# Altium schematic sheet ET-FPGAIO.SchDoc
size A4
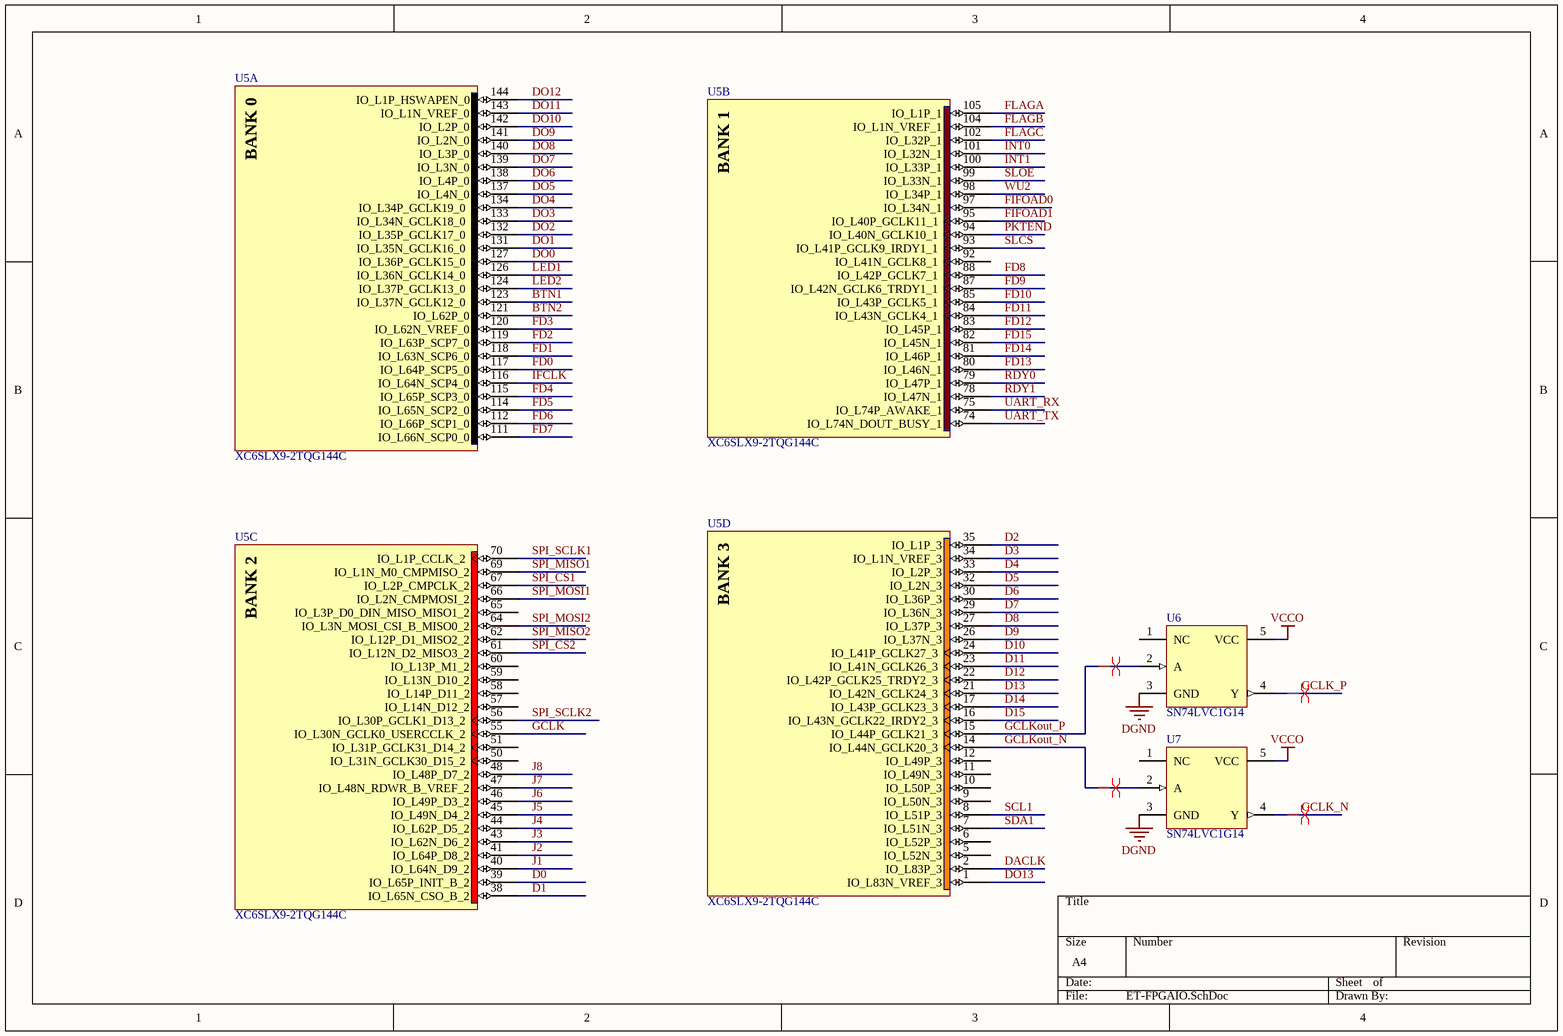
[diagram p0: ET-FPGAIO.SchDoc]

## Parts
U5  XC6SLX9-2TQG144C  [TQG144_N]  (parts A,B,C,D of 7)
U6  SN74LVC1G14  [SOT-23-5]
U7  SN74LVC1G14  [SOT-23-5]

## Nets
DGND: U6.3(GND) U7.3(GND)
VCCO: U6.5(VCC) U7.5(VCC)
~{INT0}: U5.101(IO_L32N_1)
~{INT1}: U5.100(IO_L33P_1)
~{SLCS}: U5.93(IO_L41P_GCLK9_IRDY1_1)
BTN1: U5.123(IO_L37N_GCLK12_0)
BTN2: U5.121(IO_L62P_0)
D0: U5.39(IO_L65P_INIT_B_2)
D1: U5.38(IO_L65N_CSO_B_2)
D2: U5.35(IO_L1P_3)
D3: U5.34(IO_L1N_VREF_3)
D4: U5.33(IO_L2P_3)
D5: U5.32(IO_L2N_3)
D6: U5.30(IO_L36P_3)
D7: U5.29(IO_L36N_3)
D8: U5.27(IO_L37P_3)
D9: U5.26(IO_L37N_3)
D10: U5.24(IO_L41P_GCLK27_3)
D11: U5.23(IO_L41N_GCLK26_3)
D12: U5.22(IO_L42P_GCLK25_TRDY2_3)
D13: U5.21(IO_L42N_GCLK24_3)
D14: U5.17(IO_L43P_GCLK23_3)
D15: U5.16(IO_L43N_GCLK22_IRDY2_3)
DACLK: U5.2(IO_L83P_3)
DO0: U5.127(IO_L36P_GCLK15_0)
DO1: U5.131(IO_L35N_GCLK16_0)
DO2: U5.132(IO_L35P_GCLK17_0)
DO3: U5.133(IO_L34N_GCLK18_0)
DO4: U5.134(IO_L34P_GCLK19_0)
DO5: U5.137(IO_L4N_0)
DO6: U5.138(IO_L4P_0)
DO7: U5.139(IO_L3N_0)
DO8: U5.140(IO_L3P_0)
DO9: U5.141(IO_L2N_0)
DO10: U5.142(IO_L2P_0)
DO11: U5.143(IO_L1N_VREF_0)
DO12: U5.144(IO_L1P_HSWAPEN_0)
DO13: U5.1(IO_L83N_VREF_3)
FD0: U5.117(IO_L64P_SCP5_0)
FD1: U5.118(IO_L63N_SCP6_0)
FD2: U5.119(IO_L63P_SCP7_0)
FD3: U5.120(IO_L62N_VREF_0)
FD4: U5.115(IO_L65P_SCP3_0)
FD5: U5.114(IO_L65N_SCP2_0)
FD6: U5.112(IO_L66P_SCP1_0)
FD7: U5.111(IO_L66N_SCP0_0)
FD8: U5.88(IO_L42P_GCLK7_1)
FD9: U5.87(IO_L42N_GCLK6_TRDY1_1)
FD10: U5.85(IO_L43P_GCLK5_1)
FD11: U5.84(IO_L43N_GCLK4_1)
FD12: U5.83(IO_L45P_1)
FD13: U5.80(IO_L46N_1)
FD14: U5.81(IO_L46P_1)
FD15: U5.82(IO_L45N_1)
FIFOAD0: U5.97(IO_L34N_1)
FIFOAD1: U5.95(IO_L40P_GCLK11_1)
FLAGA: U5.105(IO_L1P_1)
FLAGB: U5.104(IO_L1N_VREF_1)
FLAGC: U5.102(IO_L32P_1)
GCLK: U5.55(IO_L30N_GCLK0_USERCCLK_2)
GCLK_N: U7.4(Y)
GCLK_P: U6.4(Y)
GCLKout_N: U5.14(IO_L44N_GCLK20_3) U7.2(A)
GCLKout_P: U5.15(IO_L44P_GCLK21_3) U6.2(A)
IFCLK: U5.116(IO_L64N_SCP4_0)
J1: U5.40(IO_L64N_D9_2)
J2: U5.41(IO_L64P_D8_2)
J3: U5.43(IO_L62N_D6_2)
J4: U5.44(IO_L62P_D5_2)
J5: U5.45(IO_L49N_D4_2)
J6: U5.46(IO_L49P_D3_2)
J7: U5.47(IO_L48N_RDWR_B_VREF_2)
J8: U5.48(IO_L48P_D7_2)
LED1: U5.126(IO_L36N_GCLK14_0)
LED2: U5.124(IO_L37P_GCLK13_0)
PKTEND: U5.94(IO_L40N_GCLK10_1)
RDY0: U5.79(IO_L47P_1)
RDY1: U5.78(IO_L47N_1)
SCL1: U5.8(IO_L51P_3)
SDA1: U5.7(IO_L51N_3)
SLOE: U5.99(IO_L33N_1)
SPI_CS1: U5.67(IO_L2P_CMPCLK_2)
SPI_CS2: U5.61(IO_L12N_D2_MISO3_2)
SPI_MISO1: U5.69(IO_L1N_M0_CMPMISO_2)
SPI_MISO2: U5.62(IO_L12P_D1_MISO2_2)
SPI_MOSI1: U5.66(IO_L2N_CMPMOSI_2)
SPI_MOSI2: U5.64(IO_L3N_MOSI_CSI_B_MISO0_2)
SPI_SCLK1: U5.70(IO_L1P_CCLK_2)
SPI_SCLK2: U5.56(IO_L30P_GCLK1_D13_2)
UART_RX: U5.75(IO_L74P_AWAKE_1)
UART_TX: U5.74(IO_L74N_DOUT_BUSY_1)
WU2: U5.98(IO_L34P_1)

Not connected (* = marked no-connect by the designer): U5 5(IO_L52N_3) 6(IO_L52P_3) 9(IO_L50N_3) 10(IO_L50P_3) 11(IO_L49N_3) 12(IO_L49P_3) 50(IO_L31N_GCLK30_D15_2) 51(IO_L31P_GCLK31_D14_2) 57(IO_L14N_D12_2) 58(IO_L14P_D11_2) 59(IO_L13N_D10_2) 60(IO_L13P_M1_2) 65(IO_L3P_D0_DIN_MISO_MISO1_2) 92(IO_L41N_GCLK8_1); U6 1(NC); U7 1(NC)

## Layout directives
differential pair: GCLK_N, GCLK_P, GCLKout_N, GCLKout_P

## Notes on the sheet
- (in symbol XC6SLX9-2TQG144C, part A) BANK 0
- (in symbol XC6SLX9-2TQG144C, part B) BANK 1
- (in symbol XC6SLX9-2TQG144C, part C) BANK 2
- (in symbol XC6SLX9-2TQG144C, part D) BANK 3

## Library data of the parts
U5 = XC6SLX9-2TQG144C: Spartan-6 LX 1.2V FPGA, 102 User I/Os, 144-Pin TQFP (0.5mm Pitch), Speed Grade 2, Commercial Grade, Pb-Free; Published: 17-Nov-2009; DatasheetVersion: ver1.6, Nov-2010; PackageVersion: ver1.2, Jun-2004; PackageReference: TQG144; Publisher: Altium Limited; PackageDescription: 144-Pin Thin Quad Flat Pack (TQG144) - Pb-Free; Supplier 1: Digi-Key; Supplier Part Number 1: XC6SLX9-2TQG144C-ND; Code_JEDEC: MS-026-BFB; ComponentLink1Description: Manufacturer Link; ComponentLink1URL: http://www.xilinx.com; ComponentLink2Description: Spartan-6 Datasheet; ComponentLink2URL: http://www.xilinx.com/support/documentation/data_sheets/ds160.pdf; ComponentLink3Description: Spartan-6 Documents; ComponentLink3URL: http://www.xilinx.com/support/documentation/spartan-6.htm; ComponentLink4Description: Xilinx.com Home; ComponentLink4URL: http://www.xilinx.com